# EAGLE design horse relay (EAGLE 9.3.1)
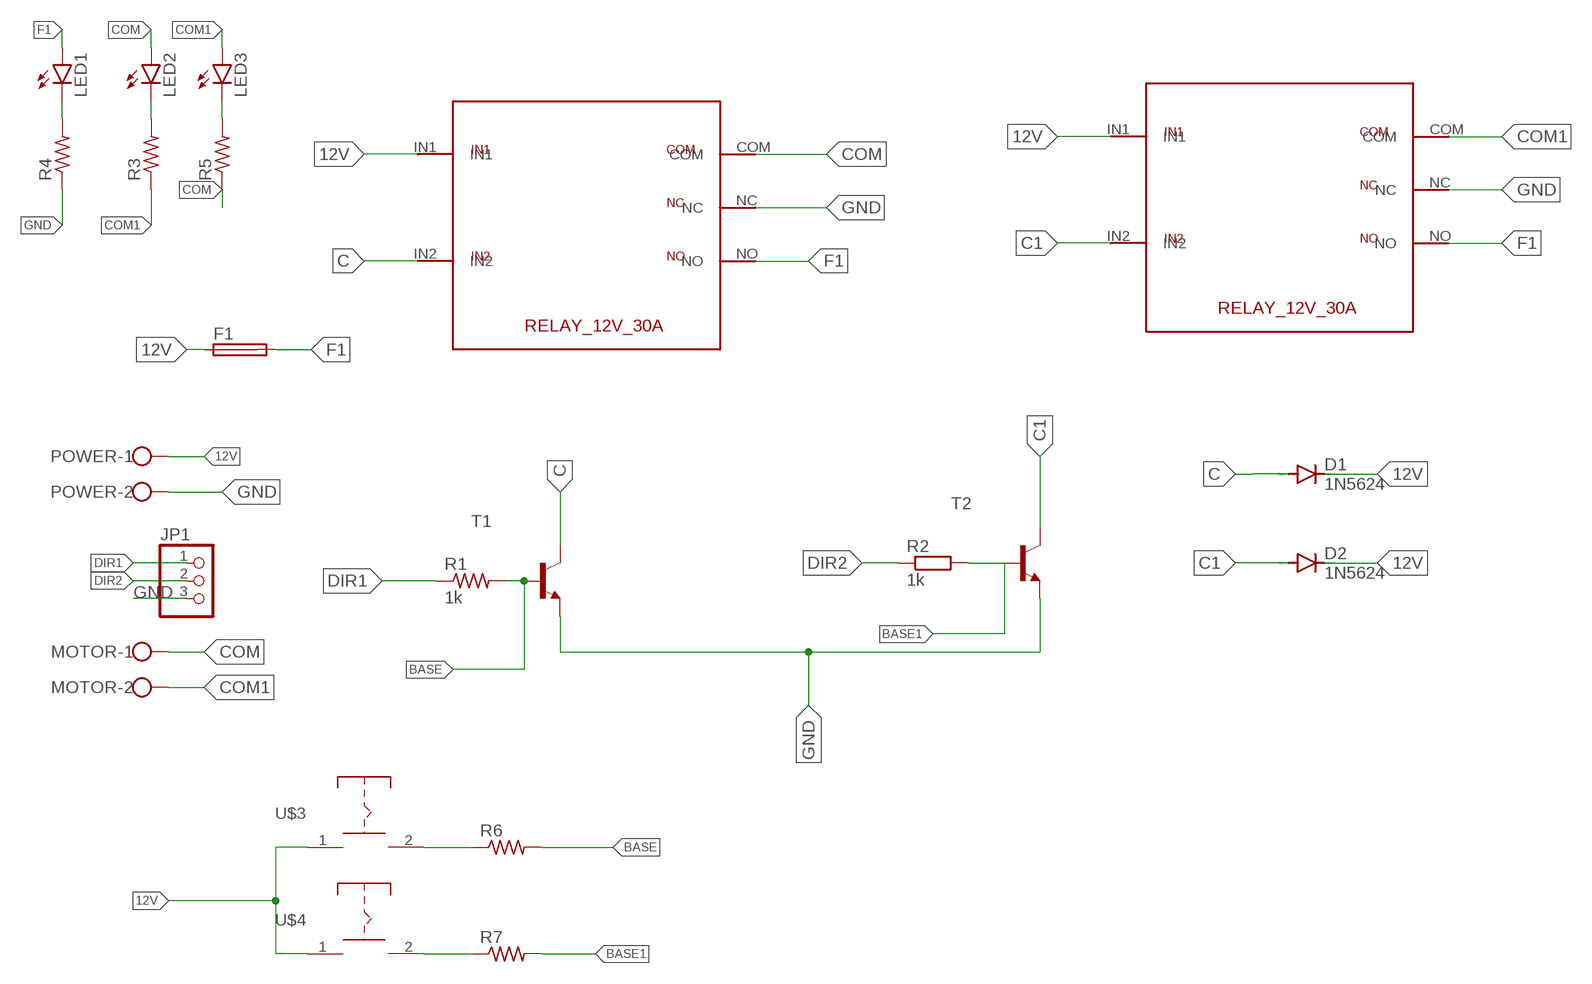
[diagram p0: schematic, sheet 1]

## Parts
D1  1N5624  [DO201-15]
D2  1N5624  [DO201-15]
F1  SH22,5A  [SH22,5A]
JP1  PINHD-1X3  [1X03]
LED1  LED5MM  [LED5MM]
LED2  LED3MM  [LED3MM]
LED3  LED3MM  [LED3MM]
MOTOR  W237-113  [W237-113]
POWER  W237-113  [W237-113]
R1  1k  R-US_0207/10  [0207/10]
R2  1k  R-EU_0204/7  [0204/7]
R3  R-US_0207/12  [0207/12]
R4  R-US_0204/7  [0204/7]
R5  R-US_0207/15  [0207/15]
R6  R-US_0207/12  [0207/12]
R7  R-US_0204/7  [0204/7]
T1  2N3904-NPN-TO92-EBC  [TO92-EBC]
T2  2N3904-NPN-TO92-EBC  [TO92-EBC]
U$1  RELAY_12V_30A  [RELAY_12V_30A]
U$2  RELAY_12V_30A  [RELAY_12V_30A]
U$3  PUSHBOTTON  [PUSHBOTTON]
U$4  PUSHBOTTON  [PUSHBOTTON]

## Nets
12V: D1.C D2.C F1.1 POWER.1 U$1.IN1 U$2.IN1 U$3.1 U$4.1
BASE: R1.2 R6.2 T1.B
BASE1: R2.2 R7.2 T2.B
C: D1.A T1.C U$1.IN2
C1: D2.A T2.C U$2.IN2
COM: LED2.A MOTOR.1 R5.1 U$1.COM
COM1: LED3.A MOTOR.2 R3.1 U$2.COM
DIR1: JP1.1 R1.1
DIR2: JP1.2 R2.1
F1: F1.2 LED1.A U$1.NO U$2.NO
GND: JP1.3 POWER.2 R4.1 T1.E T2.E U$1.NC U$2.NC
N$1: LED1.K(C) R4.2
N$2: LED2.K(C) R3.2
N$3: LED3.K(C) R5.2
N$5: R7.1 U$4.2
N$6: R6.1 U$3.2

## Library data of the parts
D1 D2 = diode:1N5624: DIODE controlled avalanche rectifier
F1 = fuse:SH22,5A: FUSE HOLDER grid 22,5mm, isolated cap OGN0031 8201, Schurter (Buerklin); MPN: 0031.7701.11; OC_FARNELL: unknown; OC_NEWARK: 04F1224
JP1 = pinhead:PINHD-1X3: PIN HEADER
LED1-LED3 = led:LED: LED OSRAM: - CHIPLED LG R971, LG N971, LY N971, LG Q971, LY Q971, LO R971, LY R971 LH N974, LH R974 LS Q976, LO Q976, LY Q976 LO Q996 - Hyper CHIPLED LW Q18S LB Q993, LB Q99A, LB R99A - SideLED LS A670, LO A670, LY A670, LG A670, LP A670 LB A673, LV A673, LT A673, LW A673 LH A674 LY A675 LS A676, LA A676, LO A676, LY A676, LW A676 LS A679, LY A679, LG A679 - Hyper Micro SIDELED® LS Y876, LA Y876, LO Y876, LY Y876 LT Y87S - SmartLED LW L88C, LW L88S LB L89C, LB L89S, LG L890 LS L89K, LO L89K, LY L89K LS L896, LA L896, LO L896, LY L896 - TOPLED LS T670, LO T670, LY T670, LG T670, LP T670 LSG T670, LSP T670, LSY T670, LOP T670, LYG T670 LG T671, LOG T671, LSG T671 LB T673, LV T673, LT T673, LW T673 LH T674 LS T676, LA T676, LO T676, LY T676, LB T676, LH T676, LSB T676, LW T676 LB T67C, LV T67C, LT T67C, LS T67K, LO T67K, LY T67K, LW E67C LS E67B, LA E67B, LO E67B, LY E67B, LB E67C, LV E67C, LT E67C LW T67C LS T679, LY T679, LG T679 LS T770, LO T770, LY T770, LG T770, LP T770 LB T773, LV T773, LT T773, LW T773 LH T774 LS E675, LA E675, LY E675, LS T675 LS T776, LA T776, LO T776, LY T776, LB T776 LHGB T686 LT T68C, LB T68C - Hyper Mini TOPLED® LB M676 - Mini TOPLED Santana® LG M470 LS M47K, LO M47K, LY M47K Source: http://www.osram.convergy.de LUXEON: - LUMILED® LXK2-PW12-R00, LXK2-PW12-S00, LXK2-PW14-U00, LXK2-PW14-V00 LXK2-PM12-R00, LXK2-PM12-S00, LXK2-PM14-U00 LXK2-PE12-Q00, LXK2-PE12-R00, LXK2-PE12-S00, LXK2-PE14-T00, LXK2-PE14-U00 LXK2-PB12-K00, LXK2-PB12-L00, LXK2-PB12-M00, LXK2-PB14-N00, LXK2-PB14-P00, LXK2-PB14-Q00 LXK2-PR12-L00, LXK2-PR12-M00, LXK2-PR14-Q00, LXK2-PR14-R00 LXK2-PD12-Q00, LXK2-PD12-R00, LXK2-PD12-S00 LXK2-PH12-R00, LXK2-PH12-S00 LXK2-PL12-P00, LXK2-PL12-Q00, LXK2-PL12-R00 Source: www.luxeon.com KINGBRIGHT: KA-3528ASYC Source: www.kingbright.com
MOTOR POWER = con-wago-500:W237-113: WAGO SCREW CLAMP; OC_FARNELL: unknown; OC_NEWARK: unknown
R1 R3-R7 = rcl:R-US_: RESISTOR, American symbol; SPICEPREFIX: R
R2 = rcl:R-EU_: RESISTOR, European symbol; SPICEPREFIX: R
T1 T2 = transistor-neu-to92:*-NPN-: NPN Transistror
U$1 U$2 = RELAY:RELAY_12V_30A
U$3 U$4 = push botton:PUSHBOTTON

## Board
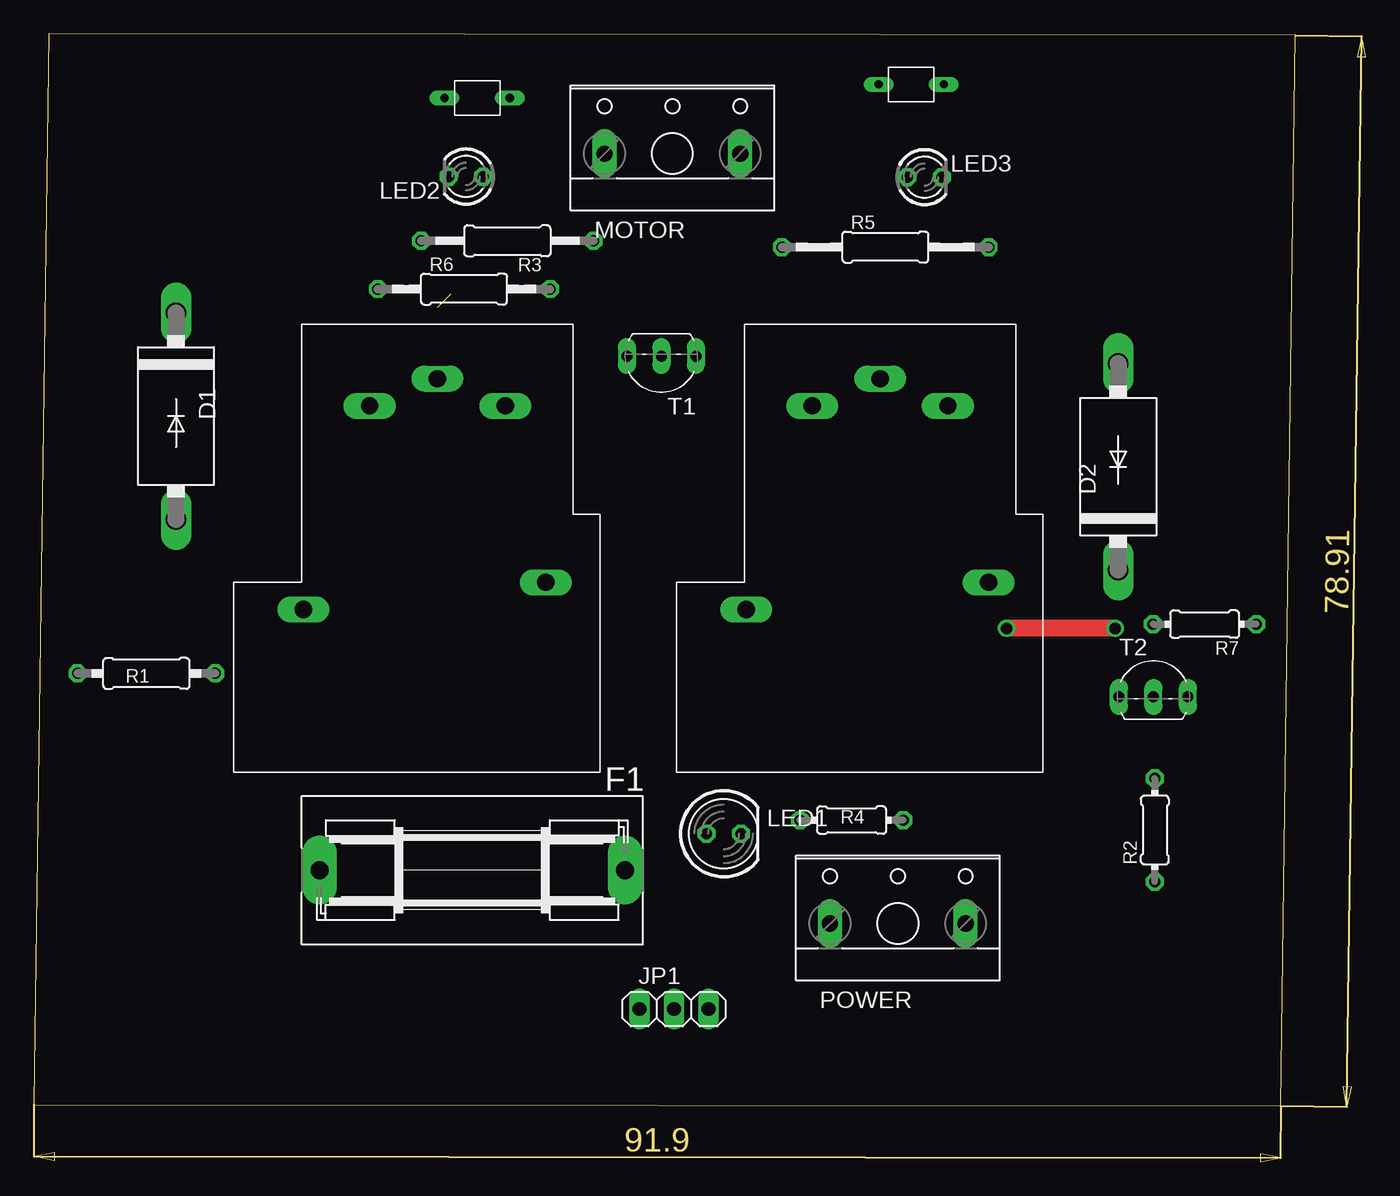
[diagram p1: board, top side]
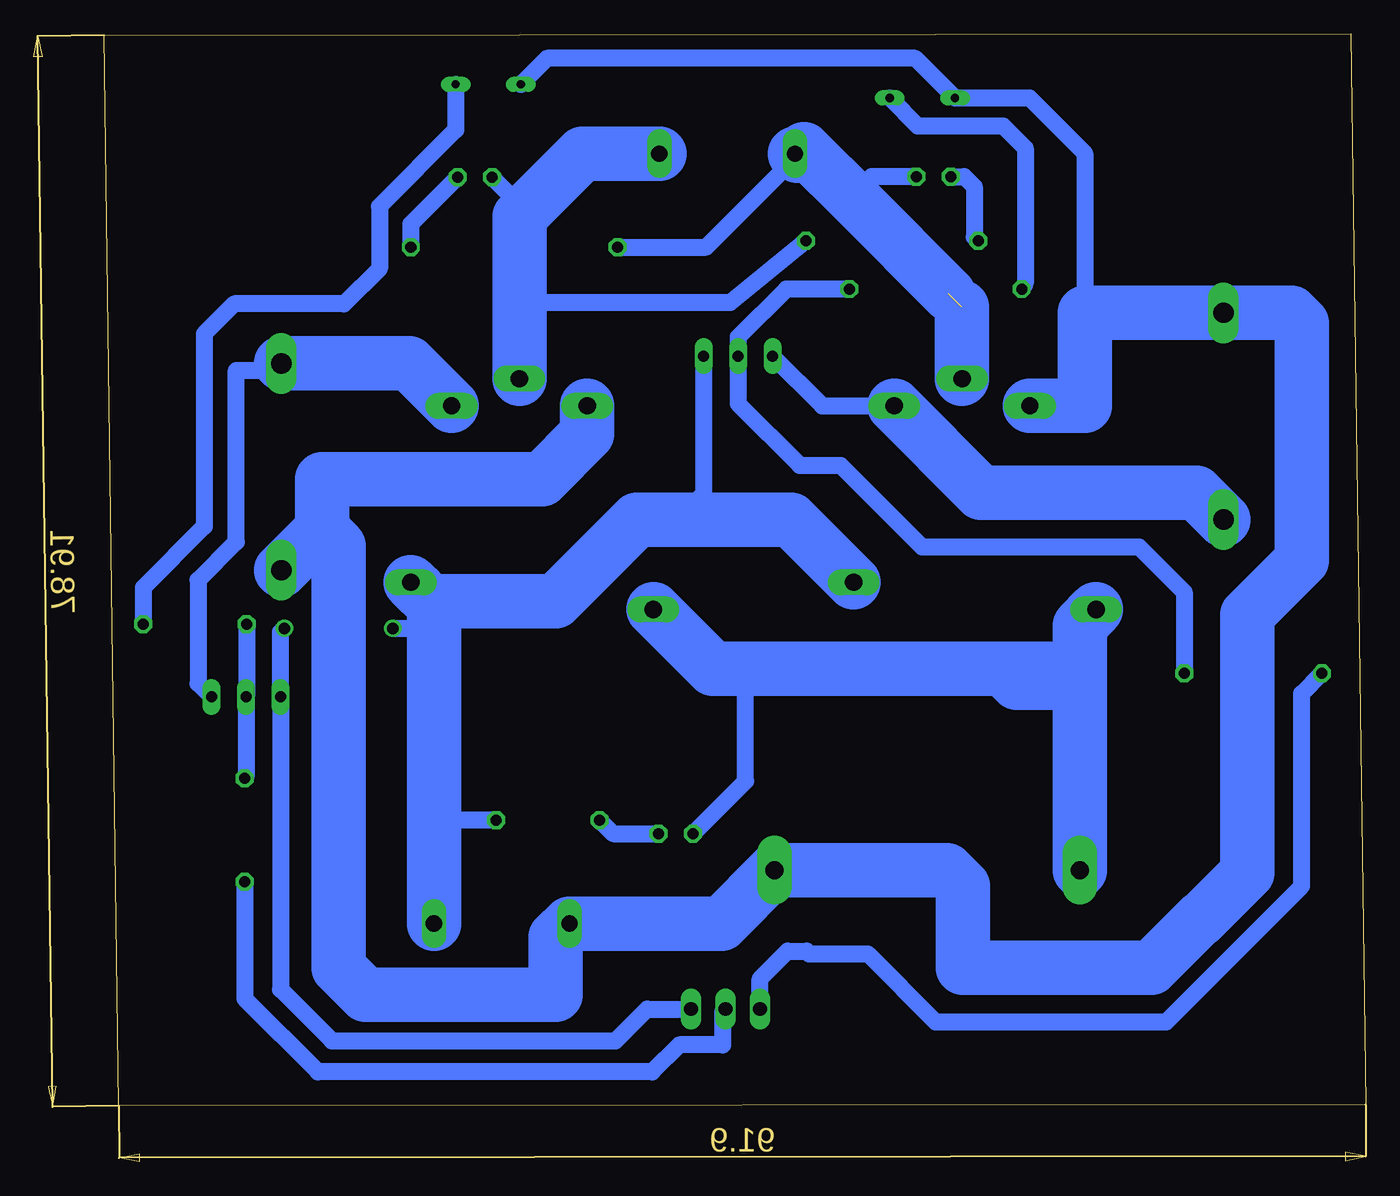
[diagram p2: board, bottom side, seen from below]

Size 93 x 79 mm. Coordinates in mm from the lower left corner, seen from the top.
Outline: 0,0.1 91.9,0 93,78.9 1.1,79 0,0.1
Copper layers (1*16): Top 0.035mm / dielectric 1.5mm / Bottom 0.035mm
Design rules "default": minimum track width 6mil, minimum drill 0.35mm, track to track 6mil, track to pad 6mil, pad to pad 6mil, via to via 6mil, smd to smd 6mil, copper to edge 40mil, drill to drill 6mil, minimum pad ring 10mil, minimum via ring 8mil, stop-mask expansion 4mil, vias tented up to drill 0mil, thermal gap 10mil

### Footprints (pad centres in the part's own frame; a part is rotated, then mirrored left to right if it is on the bottom)
DO201-15 = drill 1.499 long: A 7.62,0; C -7.62,0
SH22,5A = drill 1.321 pad 2.54 long: 1 -11.252,0; 2 11.252,0
1X03 = drill 1.016 long: 1 -2.54,0; 2 0,0; 3 2.54,0
LED5MM = drill 0.813 octagon: A -1.27,0; K 1.27,0
LED3MM = drill 0.813 octagon: A -1.27,0; K 1.27,0
W237-113 = drill 1.194 long: 1 -5,-1.27; 2 5,-1.27
0207/10 = drill 0.813 octagon: 1 -5.08,0; 2 5.08,0
0204/7 = drill 0.813 octagon: 1 -3.81,0; 2 3.81,0
0207/12 = drill 0.813 octagon: 1 -6.35,0; 2 6.35,0
0207/15 = drill 0.813 octagon: 1 -7.62,0; 2 7.62,0
TO92-EBC = drill 0.813 long: B 0,-1.27; C 2.54,-1.27; E -2.54,-1.27
RELAY_12V_30A = drill 1.27 pad 1.93 long: COM 1,2; IN1 -4,0; IN2 6,0; NC 9,-13; NO -8.873,-15
PUSHBOTTON = drill 0.6 long: 1 -12.43,5.08; 2 -7.62,5.08

### Placement (x,y rotation side)
D1  10.47,50.83 270 top
D2  79.93,47.1 90 top
F1  32.31,17.37 180 top
JP1  47.18,7.14 0 top
LED1  50.85,20.06 0 top
LED2  31.85,68.49 180 top
LED3  65.65,68.45 0 top
MOTOR  47.06,71.45 0 top
POWER  63.68,14.71 0 top
R1  8.29,31.87 0 top
R2  82.63,20.33 90 top
R3  34.9,63.75 180 top
R4  60.28,21.06 180 top
R5  62.76,63.29 0 top
R6  31.7,60.2 0 top
R7  86.3,35.5 180 top
T1  46.25,53.99 180 top
T2  82.53,31.41 0 top
U$1  28.74,51.59 0 top
U$2  61.38,51.59 0 top
U$3  42.7,69.2 0 top
U$4  74.7,70.2 0 top

### Tracks (layer width: path | path; a pad name or v marks a point on that pad's centre or on a via)
12V
  Bottom 1.27: 20.7,58.45 20.7,70.2 24.78,74.28 U$3.1 33.19,77.2 60.35,77.2 U$4.1
  Bottom 4: U$2.IN1 57.38,49.52 60.7,46.2 76.93,46.2 76.93,42.48 | 76.93,42.48 D2.C | U$1.IN1 20.7,51.59 20.7,58.45 D1.C 5.47,58.45 4.7,57.68 4.7,40.2 8.7,36.2 8.7,17.2 12.11,13.79 12.2,13.79 15.79,10.2 29.7,10.2 29.7,16.2 30.87,17.37 F1.1 47.49,13.44 POWER.1 59.7,12.42 59.7,8.2 73.7,8.2 75.7,10.2 75.7,41.25 76.93,42.48
BASE
  Bottom 1.27: R6.2 42.7,60.2 46.25,56.65 T1.B 46.25,51.75 41.7,47.2 38.7,47.2 32.7,41.2 16.7,41.2 13.37,37.87 R1.2
BASE1
  Bottom 1.27: R2.2 82.53,24.24 T2.B 82.49,30.18 R7.2
C
  Bottom 1.27: T1.C 40.04,51.59 U$1.IN2
  Bottom 4: U$1.IN2 28.35,45.2 12.46,45.2 D1.A
C1
  Bottom 1.27: D2.A 79.7,54.49 79.7,54.2 83.25,54.2 83.25,41.57 86.07,38.75 86.07,31.14 T2.C
  Bottom 4: U$2.IN2 70.51,54.72 D2.A
COM  (1 unrouted)
  Bottom 1.27: R5.1 48.61,63.29 41.89,70.01 41.39,70.51 | LED2.A 36.41,68.49 38.7,66.2 37.7,66.2 37.39,66.51
  Bottom 4: MOTOR.1 41.89,70.01 | 41.39,70.51 37.39,66.51 30.74,59.86 | 29.74,58.86 U$1.COM
COM1
  Bottom 1.27: R3.1 46.84,59.2 62.38,59.2 62.7,59.2 | LED3.A 62.13,66.2 60.7,66.2 60.7,67.2
  Bottom 4: MOTOR.2 57.72,70.18 60.7,67.2 62.38,65.52 62.38,59.2 U$2.COM
DIR1
  Bottom 1.27: R1.1 4.7,30.38 4.7,16.2 14.7,6.2 31.7,6.2 36.7,11.2 39.6,11.2 40.5,11.2 41,11.2 41.2,11.4 42.6,11.4 44.64,9.36 JP1.1
DIR2
  Bottom 1.27: R2.1 82.63,7.9 77.23,2.5 52.59,2.5 50.59,4.5 47.4,4.5 47.4,6.92 JP1.2
F1
  Bottom 1.27: LED1.A 45.7,23.94 45.7,32.2
  Bottom 4: F1.2 21.06,31.2 | 21.06,31.2 21.06,35.4 U$1.NO | 23.26,32.2 26.7,32.2 | 26.7,32.2 45.7,32.2 48.12,32.2 U$2.NO | 21.06,31.2 25.7,31.2 26.7,32.2
GND  (via drill 0.85)
  Top 1.27: v79.7,35.2 v71.7,35.2
  Bottom 1.27: R4.1 68.54,21.06 68.68,21.2 | T1.E 48.79,45.11 50.7,43.2 | 68.68,32.2 68.74,32.14 | v79.7,35.2 79.99,34.91 T2.E 79.99,8.59 76.2,4.8 55.3,4.8 52.96,7.14 JP1.3 | v71.7,35.2 70.37,35.2 68.68,36.89
  Bottom 2.54: 69.31,38.59 U$2.NC
  Bottom 4: POWER.2 68.68,21.2 68.68,32.2 68.68,36.89 U$2.NC 68.99,37.2 59.7,37.2 53.7,43.2 50.7,43.2 42.35,43.2 U$1.NC
N$1
  Bottom 1.27: R4.2 55.47,20.06 LED1.K
N$2
  Bottom 1.27: LED2.K 29.58,68.49 28.84,67.75 28.84,64.04 R3.2
N$3
  Bottom 1.27: LED3.K 70.38,64.99 R5.2
N$5
  Bottom 1.27: U$4.2 67.08,71.92 72.7,66.3 72.7,61.7 75.3,59.1 83.4,59.1 85.6,56.9 85.6,42.7 90.11,38.19 R7.1
N$6
  Bottom 1.27: U$3.2 33,72.2 26.7,72.2 25.08,70.58 25.08,60.64 R6.1